# Altium project ESP32_LED_Matrix_Heirarchal.PrjPcb
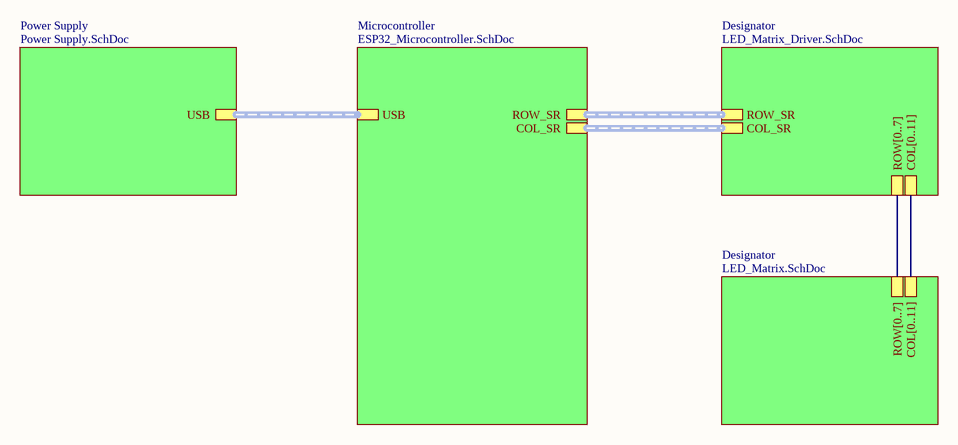
[diagram p0: ESP32_LED_Matrix.SchDoc]
5 sheets, 168 parts. Net scope: hierarchical (ports join the sheet entries above them; power ports are global).
Sheets:
  ESP32_LED_Matrix.SchDoc
    Power Supply = Power Supply.SchDoc
    Microcontroller = ESP32_Microcontroller.SchDoc
    Designator = LED_Matrix_Driver.SchDoc
    Designator = LED_Matrix.SchDoc

## Sheet ESP32_LED_Matrix.SchDoc
size A4; SheetNumber: 1; SheetTotal: 5

### Sub-sheets
Designator = LED_Matrix_Driver.SchDoc: COL_SR (harness COL_SR), ROW_SR (harness ROW_SR), ROW[0..7], COL[0..11]
Designator = LED_Matrix.SchDoc: COL[0..11], ROW[0..7]
Microcontroller = ESP32_Microcontroller.SchDoc: COL_SR (harness COL_SR), ROW_SR (harness ROW_SR), USB (harness USB)
Power Supply = Power Supply.SchDoc: USB (harness USB)

### Buses and harness runs
harness sheet Designator/COL_SR = sheet Microcontroller/COL_SR
harness sheet Designator/ROW_SR = sheet Microcontroller/ROW_SR
harness sheet Microcontroller/USB = sheet Power Supply/USB

## Sheet Power Supply.SchDoc
size A4; SheetNumber: 2; SheetTotal: 3
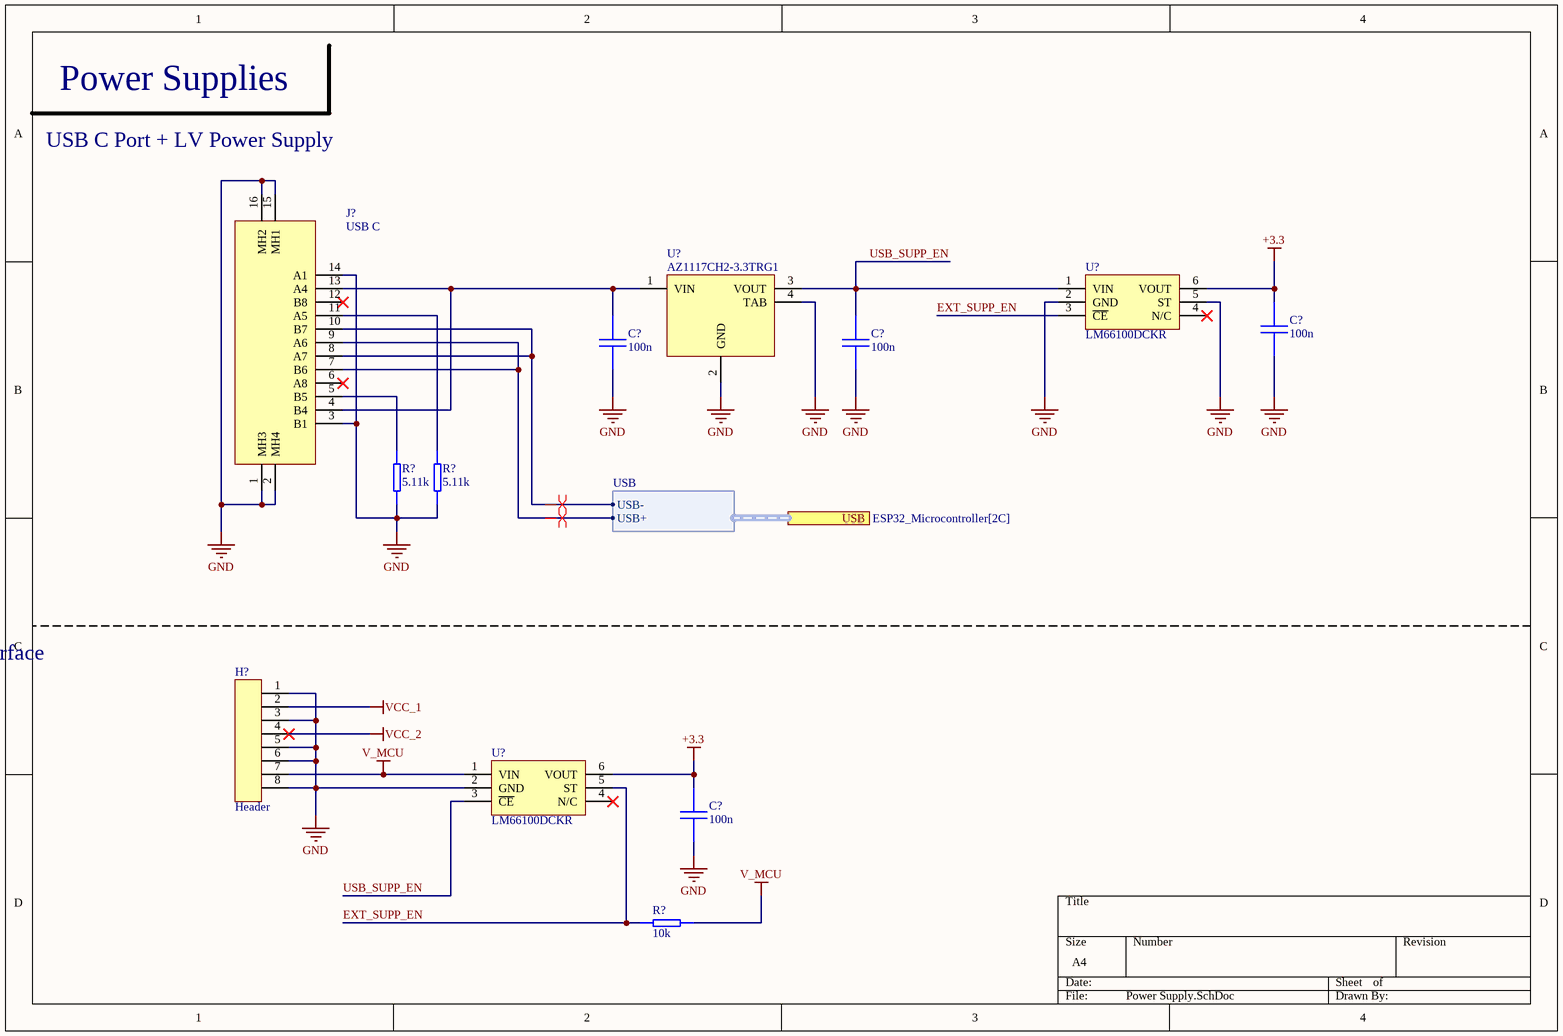
[diagram p1: Power Supply.SchDoc]

### Parts
(Parts that share a designator on the sheet are numbered #1, #2 ... from top to bottom, then left to right.)
C?#1  100n  [CAP0805]
C?#2  100n  [CAP0805]
C?#3  100n  [CAP0805]
C?#4  100n  [CAP0805]
H?  Header  [Header_1X8]
J?  USB C  [USB TYPE C 12 PIN]
R?#1  5.11k  [RESC0805]
R?#2  5.11k  [RESC0805]
R?#3  10k  [RESC0805]
U?#1  AZ1117CH2-3.3TRG1  [SOT223]
U?#2  LM66100DCKR  [SC70-6]
U?#3  LM66100DCKR  [SC70-6]

### Ports
USB (harness USB, see ESP32_Microcontroller[2C])

### Harnesses
USB: USB-, USB+

### Nets
+3.3: C?#1.1 C?#4.1 U?#2.6(VOUT) U?#3.6(VOUT)
GND: C?#1.2 C?#2.2 C?#3.2 C?#4.2 H?.1 H?.3 H?.5 H?.6 H?.8 J?.1(MH3) J?.2(MH4) J?.3(B1) J?.14(A1) J?.15(MH1) J?.16(MH2) R?#1.1 R?#2.1 U?#1.2(GND) U?#1.4(TAB) U?#2.2(GND) U?#2.5(ST) U?#3.2(GND)
V_MCU: H?.7 R?#3.2 U?#3.1(VIN)
VCC_1: H?.2
VCC_2: H?.4
EXT_SUPP_EN: R?#3.1 U?#2.3(~{CE}) U?#3.5(ST)
USB_D_N: J?.8(A7) J?.10(B7) ; port USB.USB-
USB_D_P: J?.7(B6) J?.9(A6) ; port USB.USB+
USB_SUPP_EN: C?#3.1 U?#1.3(VOUT) U?#2.1(VIN) U?#3.3(~{CE})
NetC?#2_1: C?#2.1 J?.4(B4) J?.13(A4) U?#1.1(VIN)
NetJ?_5: J?.5(B5) R?#1.2
NetJ?_11: J?.11(A5) R?#2.2

Not connected (* = marked no-connect by the designer): J? 6(A8)* 12(B8)*; U?#2 4(N/C)*; U?#3 4(N/C)*

### Layout directives
differential pair: USB_D_N, USB_D_P

### Notes on the sheet
- Power Supplies
- USB C Port + LV Power Supply
- Power Interface

### Library data of the parts
C?#1-C?#4 = Capacitor - Non Polarized: Non Polarized Capacitor
H? = 8-Pin Header: System: Connector
J? = USB Type C Connector 12 Pin
R?#1-R?#3 = Resistor
U?#1 = AZ1117CH2-3.3TRG1_1: 3.3V Linear Voltage Regulator
U?#2 U?#3 = LM66100DCKR: 5.5-V, 1.5-A 79-mΩ, Low IQ Ideal Diode With Input Polarity Protection; Manufacturer_Name: Texas Instruments; Datasheet Link: http://www.ti.com/lit/gpn/LM66100; Height: 1.1mm; Manufacturer_Part_Number: LM66100DCKR; Mouser Part Number: 595-LM66100DCKR; Mouser Price/Stock: https://www.mouser.co.uk/ProductDetail/Texas-Instruments/LM66100DCKR?qs=vLWxofP3U2y2yPPrXoBBoA%3D%3D; Arrow Part Number: LM66100DCKR; Arrow Price/Stock: https://www.arrow.com/en/products/lm66100dckr/texas-instruments?region=nac

## Sheet ESP32_Microcontroller.SchDoc
size A4; SheetNumber: 2; SheetTotal: 4
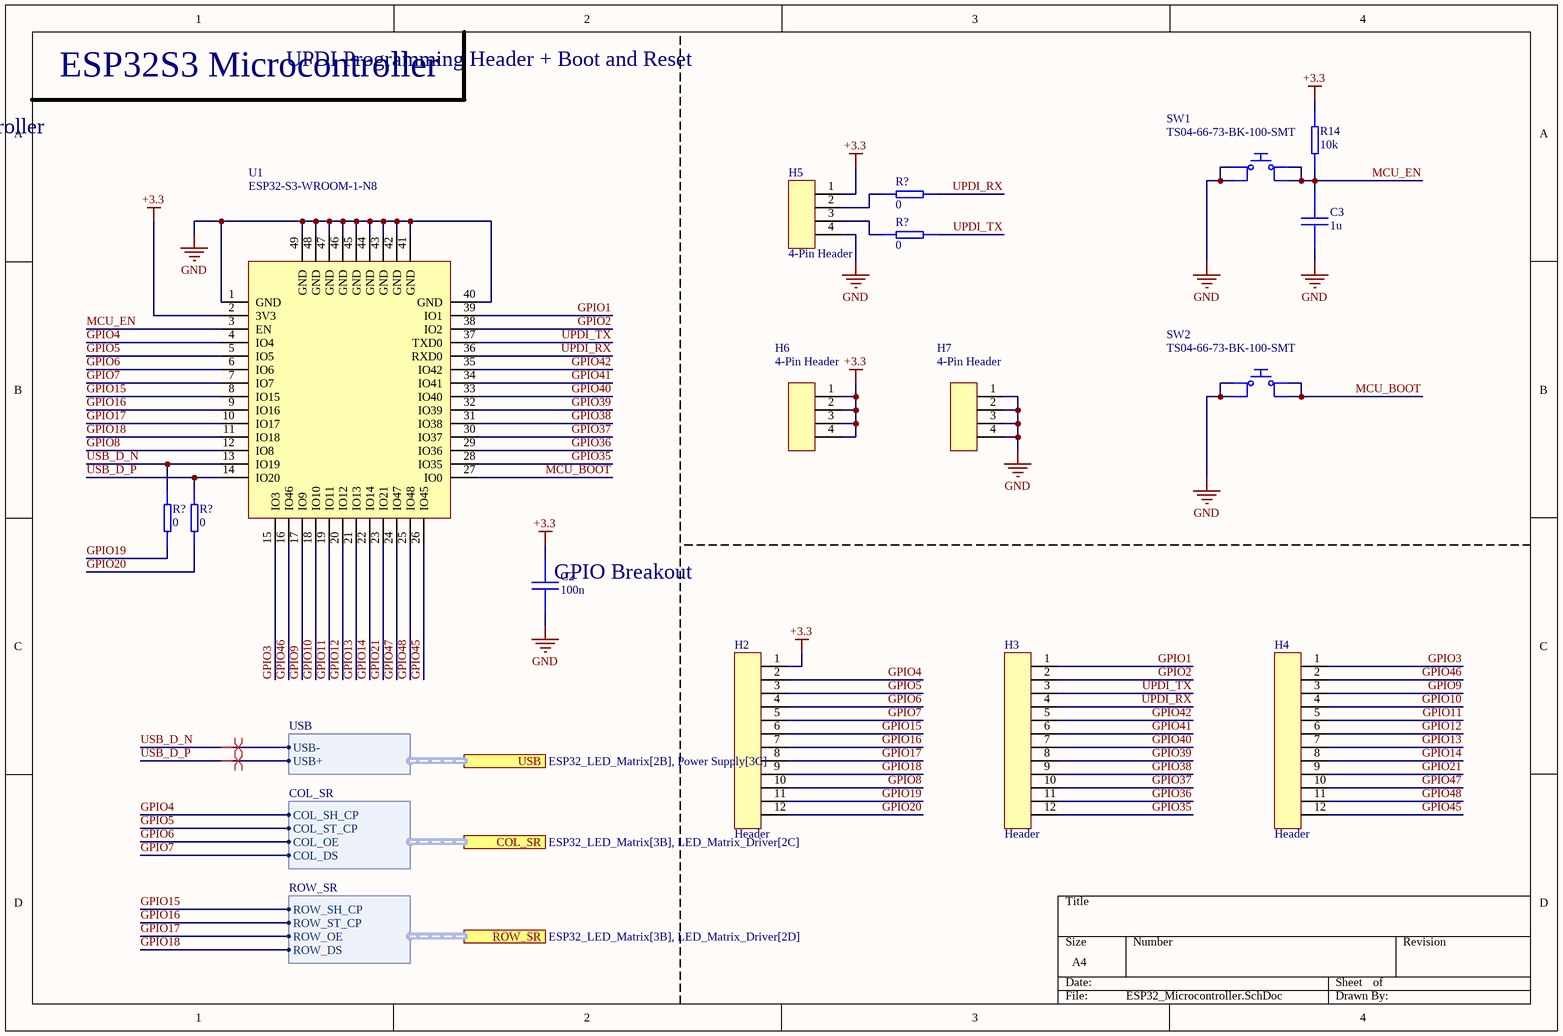
[diagram p2: ESP32_Microcontroller.SchDoc]

### Parts
(Parts that share a designator on the sheet are numbered #1, #2 ... from top to bottom, then left to right.)
C2  100n  [CAP0805]
C3  1u  [CAP0805]
H2  Header  [Header_1X12]
H3  Header  [Header_1X12]
H4  Header  [Header_1X12]
H5  4-Pin Header  [Header_1X4]
H6  4-Pin Header  [Header_1X4]
H7  4-Pin Header  [Header_1X4]
R14  10k  [RESC0805]
R?#4  0  [RESC0805]
R?#5  0  [RESC0805]
R?#6  0  [RESC0805]
R?#7  0  [RESC0805]
SW1  TS04-66-73-BK-100-SMT  [Tactile Button 6.0mm x 6.0mm]
SW2  TS04-66-73-BK-100-SMT  [Tactile Button 6.0mm x 6.0mm]
U1  ESP32-S3-WROOM-1-N8  [ESP32-S3-WROOM-1-N8]

### Ports
COL_SR (harness COL_SR, see ESP32_LED_Matrix[3B], LED_Matrix_Driver[2C]), ROW_SR (harness ROW_SR, see ESP32_LED_Matrix[3B], LED_Matrix_Driver[2D]), USB (harness USB, see ESP32_LED_Matrix[2B], Power Supply[3C])

### Harnesses
COL_SR: COL_SH_CP, COL_ST_CP, COL_OE, COL_DS
ROW_SR: ROW_SH_CP, ROW_ST_CP, ROW_OE, ROW_DS
USB: USB-, USB+

### Nets
+3.3: C2.1 H2.1 H5.1 H6.1 H6.2 H6.3 H6.4 R14.1 U1.2(3V3)
GND: C2.2 C3.2 H5.4 H7.1 H7.2 H7.3 H7.4 SW1.1 SW1.2 SW2.1 SW2.2 U1.1(GND) U1.40(GND) U1.41(GND) U1.42(GND) U1.43(GND) U1.44(GND) U1.45(GND) U1.46(GND) U1.47(GND) U1.48(GND) U1.49(GND)
GPIO1: H3.1 U1.39(IO1)
GPIO2: H3.2 U1.38(IO2)
GPIO3: H4.1 U1.15(IO3)
GPIO4: H2.2 U1.4(IO4) ; port COL_SR.COL_SH_CP  [project net COL_SH_CP]
GPIO5: H2.3 U1.5(IO5) ; port COL_SR.COL_ST_CP  [project net COL_ST_CP]
GPIO6: H2.4 U1.6(IO6) ; port COL_SR.COL_OE  [project net COL_OE]
GPIO7: H2.5 U1.7(IO7) ; port COL_SR.COL_DS  [project net COL_DS]
GPIO8: H2.10 U1.12(IO8)
GPIO9: H4.3 U1.17(IO9)
GPIO10: H4.4 U1.18(IO10)
GPIO11: H4.5 U1.19(IO11)
GPIO12: H4.6 U1.20(IO12)
GPIO13: H4.7 U1.21(IO13)
GPIO14: H4.8 U1.22(IO14)
GPIO15: H2.6 U1.8(IO15) ; port ROW_SR.ROW_SH_CP
GPIO16: H2.7 U1.9(IO16) ; port ROW_SR.ROW_ST_CP
GPIO17: H2.8 U1.10(IO17) ; port ROW_SR.ROW_OE
GPIO18: H2.9 U1.11(IO18) ; port ROW_SR.ROW_DS
GPIO19: H2.11 R?#6.1
GPIO20: H2.12 R?#7.1
GPIO21: H4.9 U1.23(IO21)
GPIO35: H3.12 U1.28(IO35)
GPIO36: H3.11 U1.29(IO36)
GPIO37: H3.10 U1.30(IO37)
GPIO38: H3.9 U1.31(IO38)
GPIO39: H3.8 U1.32(IO39)
GPIO40: H3.7 U1.33(IO40)
GPIO41: H3.6 U1.34(IO41)
GPIO42: H3.5 U1.35(IO42)
GPIO45: H4.12 U1.26(IO45)
GPIO46: H4.2 U1.16(IO46)
GPIO47: H4.10 U1.24(IO47)
GPIO48: H4.11 U1.25(IO48)
MCU_BOOT: SW2.3 SW2.4 U1.27(IO0)
MCU_EN: C3.1 R14.2 SW1.3 SW1.4 U1.3(EN)
UPDI_RX: H3.4 R?#4.1 U1.36(RXD0)
UPDI_TX: H3.3 R?#5.1 U1.37(TXD0)
USB_D_N: R?#6.2 U1.13(IO19) ; port USB.USB-
USB_D_P: R?#7.2 U1.14(IO20) ; port USB.USB+
NetH5_2: H5.2 R?#4.2
NetH5_3: H5.3 R?#5.2

### Layout directives
differential pair: USB_D_N, USB_D_P

### Notes on the sheet
- ESP32S3 Microcontroller
- UPDI Programming Header + Boot and Reset
- Microcontroller
- GPIO Breakout

### Library data of the parts
C2 C3 = Capacitor - Non Polarized: Non Polarized Capacitor
H2-H4 = 12-Pin Header
R14 R?#4-R?#7 = Resistor
SW1 SW2 = TS04-66-73-BK-100-SMT: Switch; Manufacturer_Name: Same Sky; Datasheet Link: https://www.sameskydevices.com/product/resource/supplyframepdf/ts04.pdf; Height: 7.6mm; Manufacturer_Part_Number: TS04-66-73-BK-100-SMT; Mouser Part Number: 179-TS046673BK100SMT; Mouser Price/Stock: https://www.mouser.co.uk/ProductDetail/Same-Sky/TS04-66-73-BK-100-SMT?qs=A6eO%252BMLsxmRAmp3wqRUzZw%3D%3D; Arrow Part Number: TS04-66-73-BK-100-SMT; Arrow Price/Stock: https://www.arrow.com/en/products/ts04-66-73-bk-100-smt/cui-devices?utm_currency=USD&region=nac
U1 = ESP32-S3-WROOM-1-N8: ESP32 Microcontroller with Bluetooth and Wifi

## Sheet LED_Matrix_Driver.SchDoc
size A3; SheetNumber: 4; SheetTotal: 4
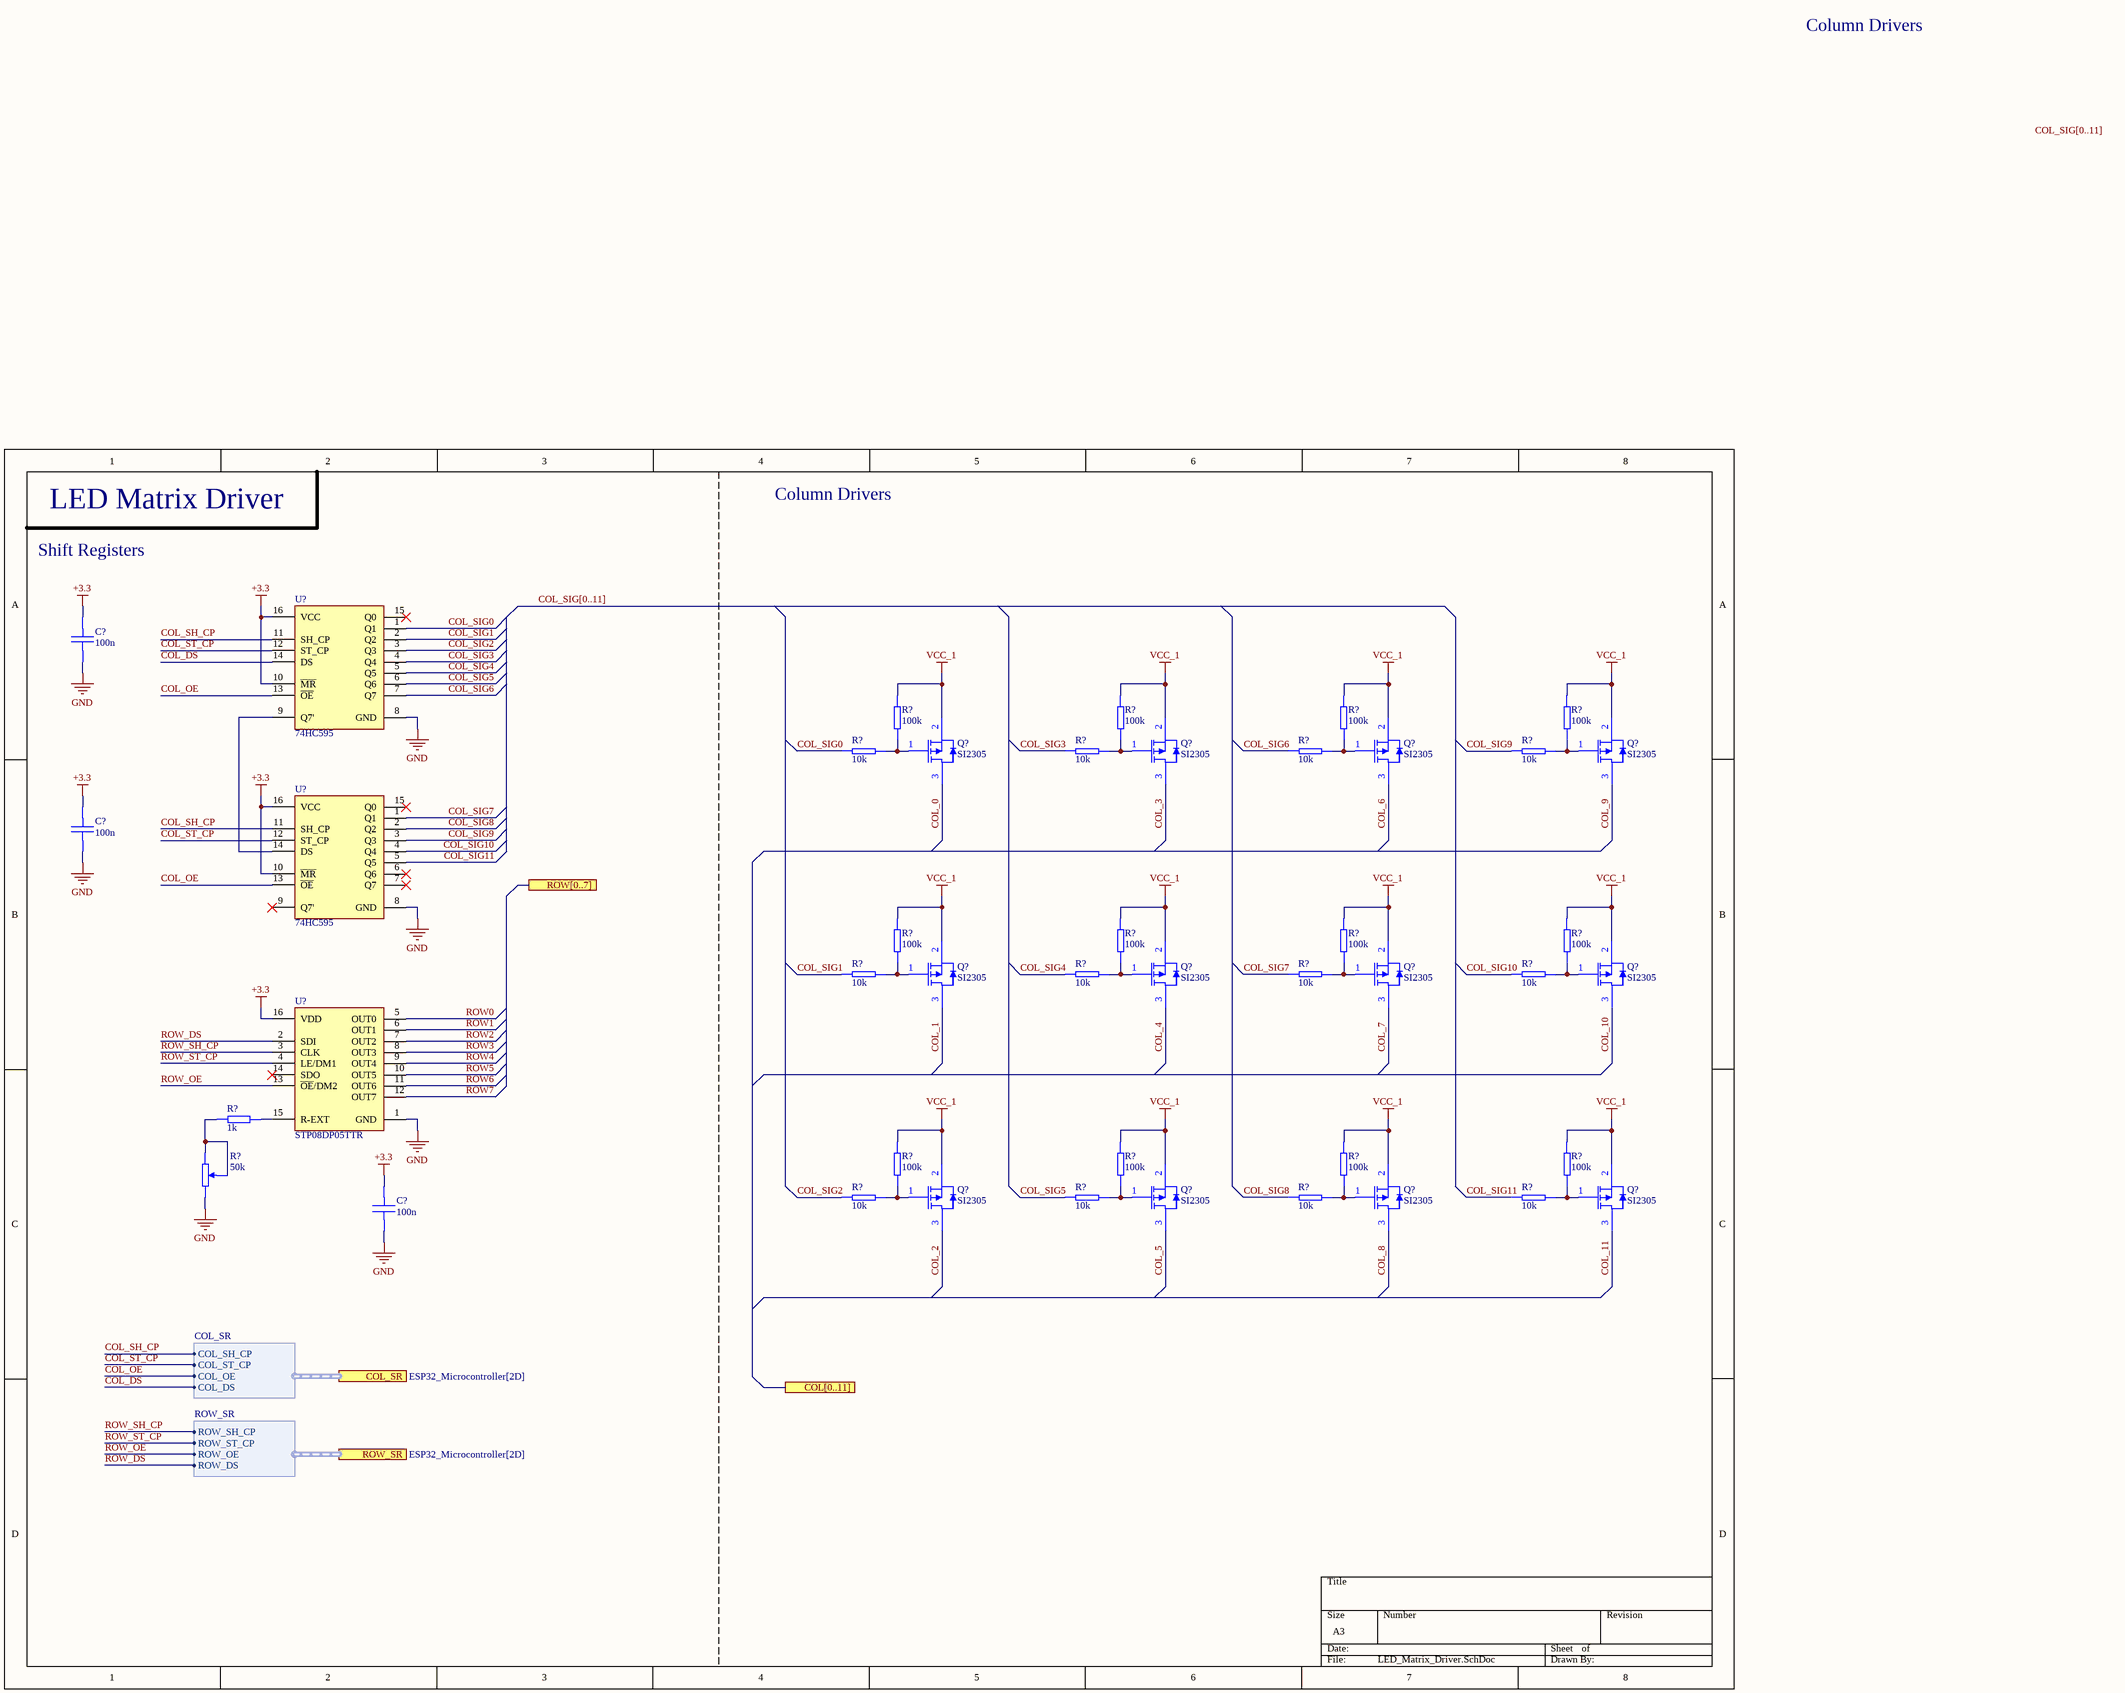
[diagram p3: LED_Matrix_Driver.SchDoc]

### Parts
(Parts that share a designator on the sheet are numbered #1, #2 ... from top to bottom, then left to right.)
C?#5  100n  [CAP0805]
C?#6  100n  [CAP0805]
C?#7  100n  [CAP0805]
Q?#1  SI2305  [SOT23]
Q?#2  SI2305  [SOT23]
Q?#3  SI2305  [SOT23]
Q?#4  SI2305  [SOT23]
Q?#5  SI2305  [SOT23]
Q?#6  SI2305  [SOT23]
Q?#7  SI2305  [SOT23]
Q?#8  SI2305  [SOT23]
Q?#9  SI2305  [SOT23]
Q?#10  SI2305  [SOT23]
Q?#11  SI2305  [SOT23]
Q?#12  SI2305  [SOT23]
R?#8  100k  [RESC0805]
R?#9  100k  [RESC0805]
R?#10  100k  [RESC0805]
R?#11  100k  [RESC0805]
R?#12  10k  [RESC0805]
R?#13  10k  [RESC0805]
R?#14  10k  [RESC0805]
R?#15  10k  [RESC0805]
R?#16  100k  [RESC0805]
R?#17  100k  [RESC0805]
R?#18  100k  [RESC0805]
R?#19  100k  [RESC0805]
R?#20  10k  [RESC0805]
R?#21  10k  [RESC0805]
R?#22  10k  [RESC0805]
R?#23  10k  [RESC0805]
R?#24  1k  [RESC0805]
R?#25  100k  [RESC0805]
R?#26  100k  [RESC0805]
R?#27  100k  [RESC0805]
R?#28  100k  [RESC0805]
R?#29  50k  [3339P1103LF]
R?#30  10k  [RESC0805]
R?#31  10k  [RESC0805]
R?#32  10k  [RESC0805]
R?#33  10k  [RESC0805]
U?#4  74HC595  [TSSOP16]
U?#5  74HC595  [TSSOP16]
U?#6  STP08DP05TTR  [TSSOP16]

### Ports
COL[0..11], COL_SR (harness COL_SR, see ESP32_Microcontroller[2D]), ROW[0..7], ROW_SR (harness ROW_SR, see ESP32_Microcontroller[2D])

### Harnesses
COL_SR: COL_SH_CP, COL_ST_CP, COL_OE, COL_DS
ROW_SR: ROW_SH_CP, ROW_ST_CP, ROW_OE, ROW_DS

### Nets
+3.3: C?#5.1 C?#6.1 C?#7.1 U?#4.10(~{MR}) U?#4.16(VCC) U?#5.10(~{MR}) U?#5.16(VCC) U?#6.16(VDD)
GND: C?#5.2 C?#6.2 C?#7.2 R?#29.3 U?#4.8(GND) U?#5.8(GND) U?#6.1(GND)
VCC_1: Q?#1.2(S) Q?#2.2(S) Q?#3.2(S) Q?#4.2(S) Q?#5.2(S) Q?#6.2(S) Q?#7.2(S) Q?#8.2(S) Q?#9.2(S) Q?#10.2(S) Q?#11.2(S) Q?#12.2(S) R?#8.1 R?#9.1 R?#10.1 R?#11.1 R?#16.1 R?#17.1 R?#18.1 R?#19.1 R?#25.1 R?#26.1 R?#27.1 R?#28.1
COL_0: Q?#1.3(D)
COL_1: Q?#5.3(D)
COL_2: Q?#9.3(D)
COL_3: Q?#2.3(D)
COL_4: Q?#6.3(D)
COL_5: Q?#10.3(D)
COL_6: Q?#3.3(D)
COL_7: Q?#7.3(D)
COL_8: Q?#11.3(D)
COL_9: Q?#4.3(D)
COL_10: Q?#8.3(D)
COL_11: Q?#12.3(D)
COL_DS: U?#4.14(DS) ; port COL_SR.COL_DS
COL_OE: U?#4.13(~{OE}) U?#5.13(~{OE}) ; port COL_SR.COL_OE
COL_SH_CP: U?#4.11(SH_CP) U?#5.11(SH_CP) ; port COL_SR.COL_SH_CP
COL_SIG0: R?#12.1 U?#4.1(Q1)
COL_SIG1: R?#20.1 U?#4.2(Q2)
COL_SIG2: R?#30.1 U?#4.3(Q3)
COL_SIG3: R?#13.1 U?#4.4(Q4)
COL_SIG4: R?#21.1 U?#4.5(Q5)
COL_SIG5: R?#31.1 U?#4.6(Q6)
COL_SIG6: R?#14.1 U?#4.7(Q7)
COL_SIG7: R?#22.1 U?#5.1(Q1)
COL_SIG8: R?#32.1 U?#5.2(Q2)
COL_SIG9: R?#15.1 U?#5.3(Q3)
COL_SIG10: R?#23.1 U?#5.4(Q4)
COL_SIG11: R?#33.1 U?#5.5(Q5)
COL_ST_CP: U?#4.12(ST_CP) U?#5.12(ST_CP) ; port COL_SR.COL_ST_CP
ROW0: U?#6.5(OUT0)
ROW1: U?#6.6(OUT1)
ROW2: U?#6.7(OUT2)
ROW3: U?#6.8(OUT3)
ROW4: U?#6.9(OUT4)
ROW5: U?#6.10(OUT5)
ROW6: U?#6.11(OUT6)
ROW7: U?#6.12(OUT7)
ROW_DS: U?#6.2(SDI) ; port ROW_SR.ROW_DS  [project net GPIO18]
ROW_OE: U?#6.13(~{OE}/DM2) ; port ROW_SR.ROW_OE  [project net GPIO17]
ROW_SH_CP: U?#6.3(CLK) ; port ROW_SR.ROW_SH_CP  [project net GPIO15]
ROW_ST_CP: U?#6.4(LE/DM1) ; port ROW_SR.ROW_ST_CP  [project net GPIO16]
NetQ?#1_1: Q?#1.1(G) R?#8.2 R?#12.2
NetQ?#2_1: Q?#2.1(G) R?#9.2 R?#13.2
NetQ?#3_1: Q?#3.1(G) R?#10.2 R?#14.2
NetQ?#4_1: Q?#4.1(G) R?#11.2 R?#15.2
NetQ?#5_1: Q?#5.1(G) R?#16.2 R?#20.2
NetQ?#6_1: Q?#6.1(G) R?#17.2 R?#21.2
NetQ?#7_1: Q?#7.1(G) R?#18.2 R?#22.2
NetQ?#8_1: Q?#8.1(G) R?#19.2 R?#23.2
NetQ?#9_1: Q?#9.1(G) R?#25.2 R?#30.2
NetQ?#10_1: Q?#10.1(G) R?#26.2 R?#31.2
NetQ?#11_1: Q?#11.1(G) R?#27.2 R?#32.2
NetQ?#12_1: Q?#12.1(G) R?#28.2 R?#33.2
NetR?#24_1: R?#24.1 U?#6.15(R-EXT)
NetR?#24_2: R?#24.2 R?#29.1 R?#29.2
NetU?#4_9: U?#4.9(Q7') U?#5.14(DS)

Not connected (* = marked no-connect by the designer): U?#4 15(Q0)*; U?#5 6(Q6)* 7(Q7)* 9(Q7')* 15(Q0)*; U?#6 14(SDO)*

### Buses and harness runs
bus COL_SIG[0..11]

### Notes on the sheet
- Column Drivers
- LED Matrix Driver
- Shift Registers
- Labels drawn without touching a wire or pin: COL_SIG[0..11]

### Library data of the parts
C?#5-C?#7 = Capacitor - Non Polarized: Non Polarized Capacitor
Q?#1-Q?#12 = SI2305: General Purpose P-Channel MOSFET; ComponentLink1Description: Datasheet; ComponentLink1URL: https://www.vishay.com/docs/64847/si2305cd.pdf
R?#8-R?#28 R?#30-R?#33 = Resistor
R?#29 = Potentiometer: Potentionmeter
U?#4 U?#5 = 74HC595: Shift Register
U?#6 = STP08DP05TTR: LED Driver; Manufacturer_Name: STMicroelectronics; Datasheet Link: https://componentsearchengine.com/Datasheets/2/STP08DP05TTR.pdf; Height: 1.2mm; Manufacturer_Part_Number: STP08DP05TTR; Mouser Part Number: 511-STP08DP05TTR; Mouser Price/Stock: https://www.mouser.co.uk/ProductDetail/STMicroelectronics/STP08DP05TTR?qs=xgiOkRdDJ0m7T%2FaY25F5vQ%3D%3D; Arrow Part Number: STP08DP05TTR; Arrow Price/Stock: https://www.arrow.com/en/products/stp08dp05ttr/stmicroelectronics?region=nac

## Sheet LED_Matrix.SchDoc
size A3; SheetNumber: 3; SheetTotal: 3
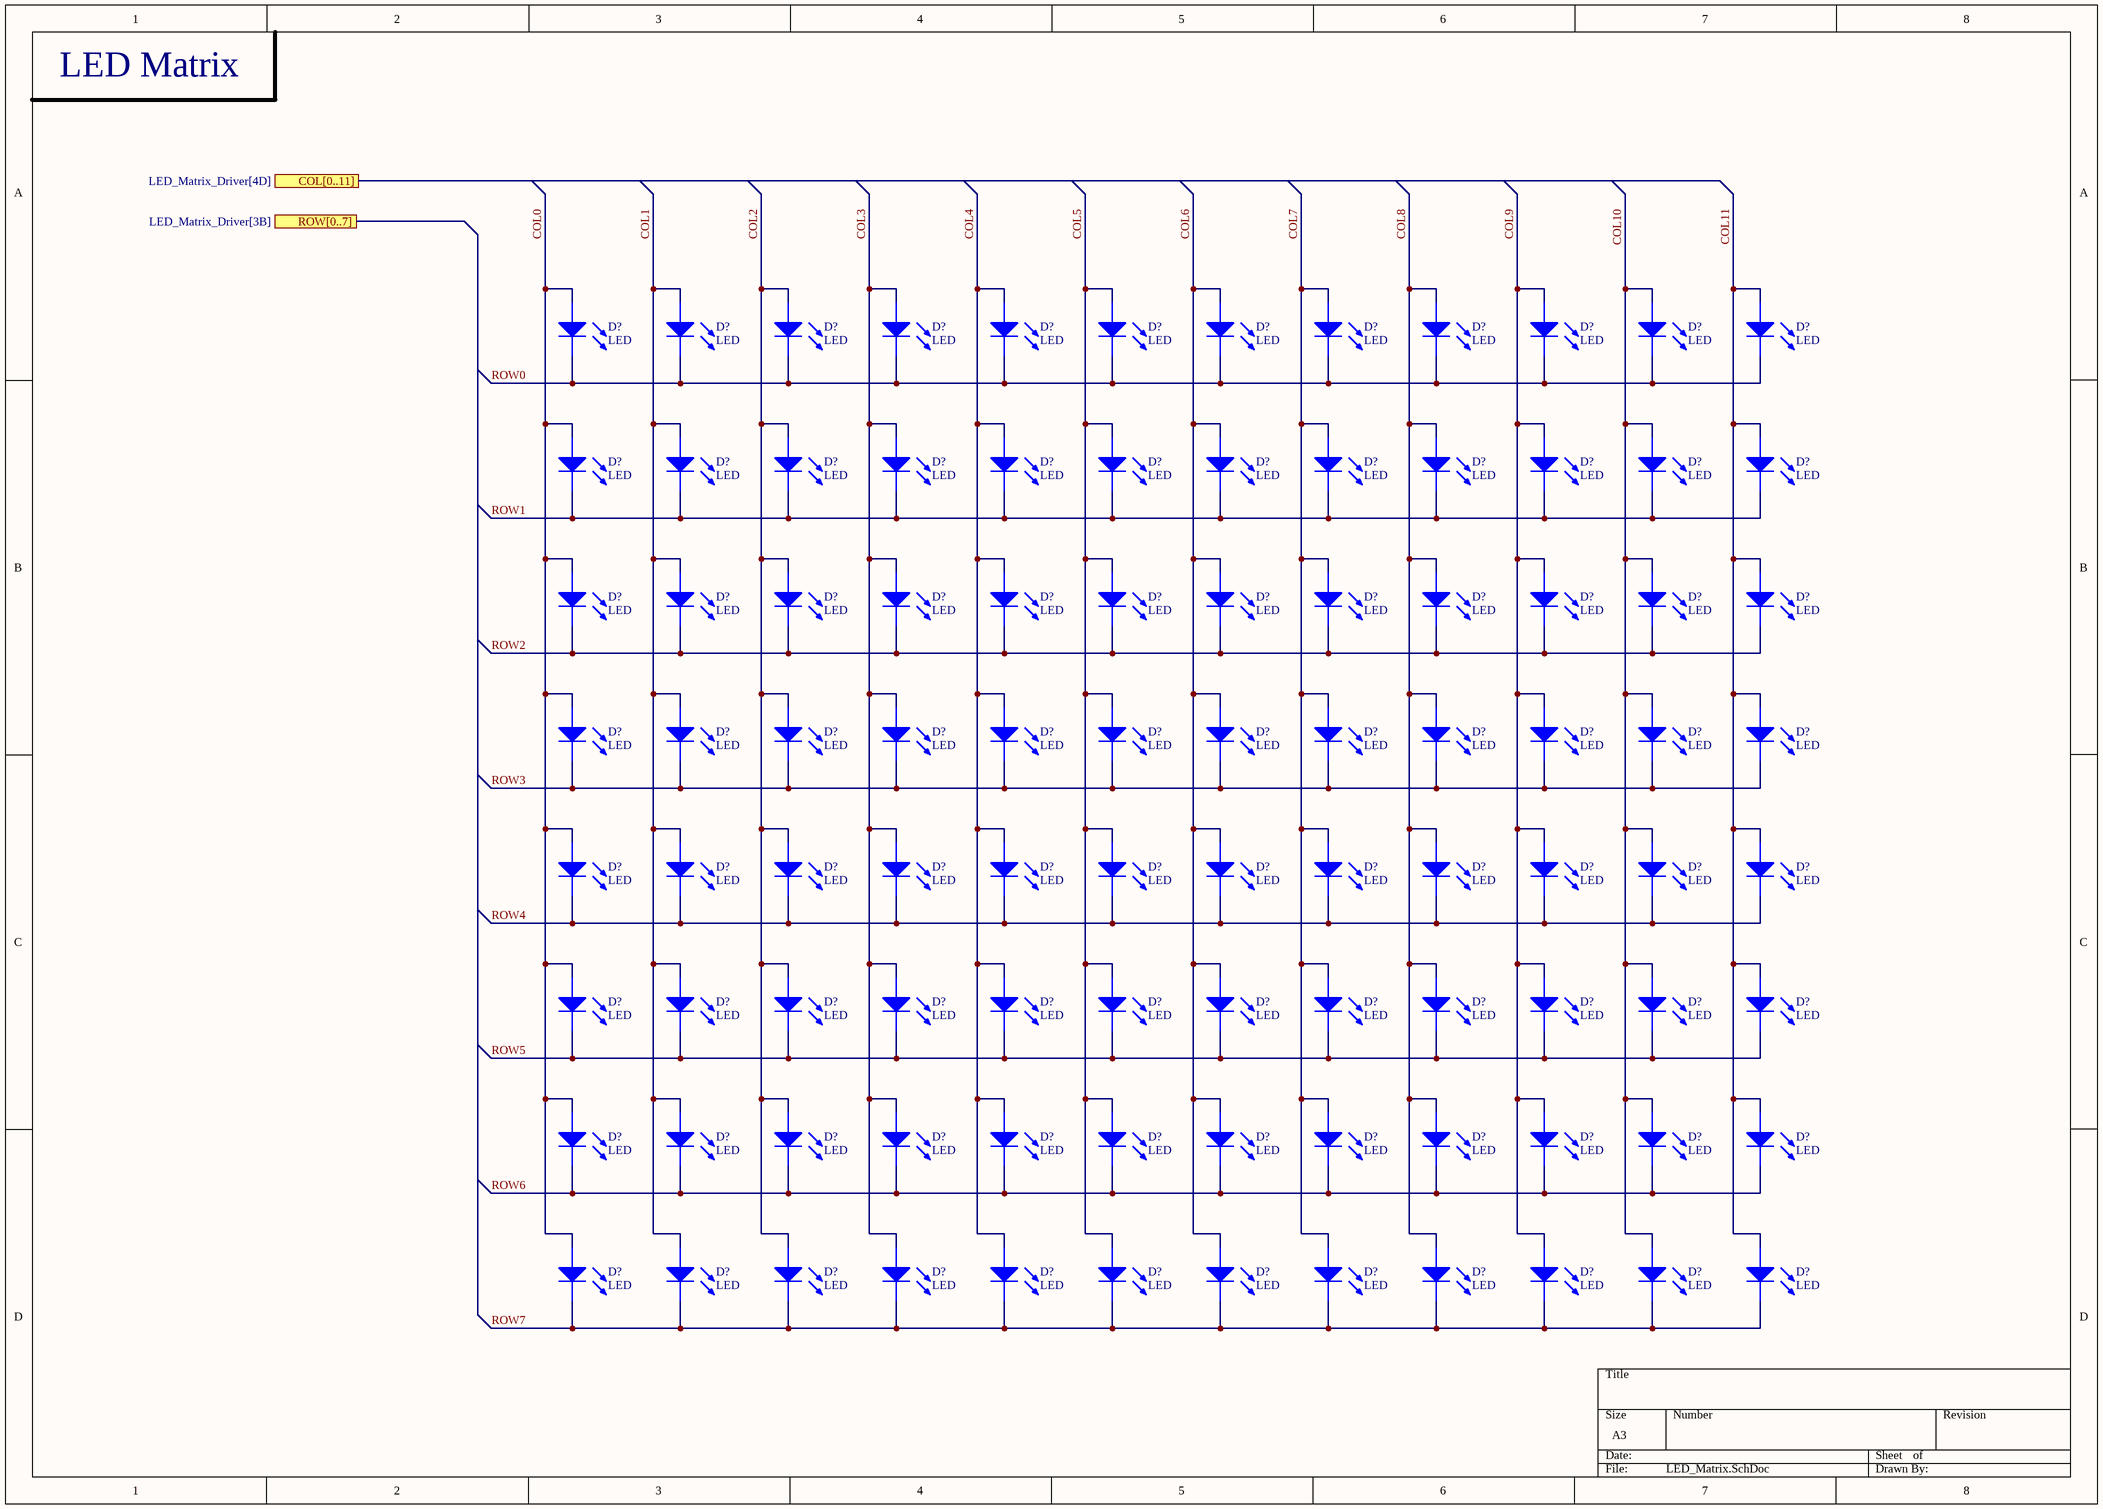
[diagram p4: LED_Matrix.SchDoc]

### Parts
(Parts that share a designator on the sheet are numbered #1, #2 ... from top to bottom, then left to right.)
D?#1  LED  [LEDM2012X80N]
D?#2  LED  [LEDM2012X80N]
D?#3  LED  [LEDM2012X80N]
D?#4  LED  [LEDM2012X80N]
D?#5  LED  [LEDM2012X80N]
D?#6  LED  [LEDM2012X80N]
D?#7  LED  [LEDM2012X80N]
D?#8  LED  [LEDM2012X80N]
D?#9  LED  [LEDM2012X80N]
D?#10  LED  [LEDM2012X80N]
D?#11  LED  [LEDM2012X80N]
D?#12  LED  [LEDM2012X80N]
D?#13  LED  [LEDM2012X80N]
D?#14  LED  [LEDM2012X80N]
D?#15  LED  [LEDM2012X80N]
D?#16  LED  [LEDM2012X80N]
D?#17  LED  [LEDM2012X80N]
D?#18  LED  [LEDM2012X80N]
D?#19  LED  [LEDM2012X80N]
D?#20  LED  [LEDM2012X80N]
D?#21  LED  [LEDM2012X80N]
D?#22  LED  [LEDM2012X80N]
D?#23  LED  [LEDM2012X80N]
D?#24  LED  [LEDM2012X80N]
D?#25  LED  [LEDM2012X80N]
D?#26  LED  [LEDM2012X80N]
D?#27  LED  [LEDM2012X80N]
D?#28  LED  [LEDM2012X80N]
D?#29  LED  [LEDM2012X80N]
D?#30  LED  [LEDM2012X80N]
D?#31  LED  [LEDM2012X80N]
D?#32  LED  [LEDM2012X80N]
D?#33  LED  [LEDM2012X80N]
D?#34  LED  [LEDM2012X80N]
D?#35  LED  [LEDM2012X80N]
D?#36  LED  [LEDM2012X80N]
D?#37  LED  [LEDM2012X80N]
D?#38  LED  [LEDM2012X80N]
D?#39  LED  [LEDM2012X80N]
D?#40  LED  [LEDM2012X80N]
D?#41  LED  [LEDM2012X80N]
D?#42  LED  [LEDM2012X80N]
D?#43  LED  [LEDM2012X80N]
D?#44  LED  [LEDM2012X80N]
D?#45  LED  [LEDM2012X80N]
D?#46  LED  [LEDM2012X80N]
D?#47  LED  [LEDM2012X80N]
D?#48  LED  [LEDM2012X80N]
D?#49  LED  [LEDM2012X80N]
D?#50  LED  [LEDM2012X80N]
D?#51  LED  [LEDM2012X80N]
D?#52  LED  [LEDM2012X80N]
D?#53  LED  [LEDM2012X80N]
D?#54  LED  [LEDM2012X80N]
D?#55  LED  [LEDM2012X80N]
D?#56  LED  [LEDM2012X80N]
D?#57  LED  [LEDM2012X80N]
D?#58  LED  [LEDM2012X80N]
D?#59  LED  [LEDM2012X80N]
D?#60  LED  [LEDM2012X80N]
D?#61  LED  [LEDM2012X80N]
D?#62  LED  [LEDM2012X80N]
D?#63  LED  [LEDM2012X80N]
D?#64  LED  [LEDM2012X80N]
D?#65  LED  [LEDM2012X80N]
D?#66  LED  [LEDM2012X80N]
D?#67  LED  [LEDM2012X80N]
D?#68  LED  [LEDM2012X80N]
D?#69  LED  [LEDM2012X80N]
D?#70  LED  [LEDM2012X80N]
D?#71  LED  [LEDM2012X80N]
D?#72  LED  [LEDM2012X80N]
D?#73  LED  [LEDM2012X80N]
D?#74  LED  [LEDM2012X80N]
D?#75  LED  [LEDM2012X80N]
D?#76  LED  [LEDM2012X80N]
D?#77  LED  [LEDM2012X80N]
D?#78  LED  [LEDM2012X80N]
D?#79  LED  [LEDM2012X80N]
D?#80  LED  [LEDM2012X80N]
D?#81  LED  [LEDM2012X80N]
D?#82  LED  [LEDM2012X80N]
D?#83  LED  [LEDM2012X80N]
D?#84  LED  [LEDM2012X80N]
D?#85  LED  [LEDM2012X80N]
D?#86  LED  [LEDM2012X80N]
D?#87  LED  [LEDM2012X80N]
D?#88  LED  [LEDM2012X80N]
D?#89  LED  [LEDM2012X80N]
D?#90  LED  [LEDM2012X80N]
D?#91  LED  [LEDM2012X80N]
D?#92  LED  [LEDM2012X80N]
D?#93  LED  [LEDM2012X80N]
D?#94  LED  [LEDM2012X80N]
D?#95  LED  [LEDM2012X80N]
D?#96  LED  [LEDM2012X80N]

### Ports
COL[0..11] (see LED_Matrix_Driver[4D]), ROW[0..7] (see LED_Matrix_Driver[3B])

### Nets
COL0: D?#1.2(A) D?#13.2(A) D?#25.2(A) D?#37.2(A) D?#49.2(A) D?#61.2(A) D?#73.2(A) D?#85.2(A)
COL1: D?#2.2(A) D?#14.2(A) D?#26.2(A) D?#38.2(A) D?#50.2(A) D?#62.2(A) D?#74.2(A) D?#86.2(A)
COL2: D?#3.2(A) D?#15.2(A) D?#27.2(A) D?#39.2(A) D?#51.2(A) D?#63.2(A) D?#75.2(A) D?#87.2(A)
COL3: D?#4.2(A) D?#16.2(A) D?#28.2(A) D?#40.2(A) D?#52.2(A) D?#64.2(A) D?#76.2(A) D?#88.2(A)
COL4: D?#5.2(A) D?#17.2(A) D?#29.2(A) D?#41.2(A) D?#53.2(A) D?#65.2(A) D?#77.2(A) D?#89.2(A)
COL5: D?#6.2(A) D?#18.2(A) D?#30.2(A) D?#42.2(A) D?#54.2(A) D?#66.2(A) D?#78.2(A) D?#90.2(A)
COL6: D?#7.2(A) D?#19.2(A) D?#31.2(A) D?#43.2(A) D?#55.2(A) D?#67.2(A) D?#79.2(A) D?#91.2(A)
COL7: D?#8.2(A) D?#20.2(A) D?#32.2(A) D?#44.2(A) D?#56.2(A) D?#68.2(A) D?#80.2(A) D?#92.2(A)
COL8: D?#9.2(A) D?#21.2(A) D?#33.2(A) D?#45.2(A) D?#57.2(A) D?#69.2(A) D?#81.2(A) D?#93.2(A)
COL9: D?#10.2(A) D?#22.2(A) D?#34.2(A) D?#46.2(A) D?#58.2(A) D?#70.2(A) D?#82.2(A) D?#94.2(A)
COL10: D?#11.2(A) D?#23.2(A) D?#35.2(A) D?#47.2(A) D?#59.2(A) D?#71.2(A) D?#83.2(A) D?#95.2(A)
COL11: D?#12.2(A) D?#24.2(A) D?#36.2(A) D?#48.2(A) D?#60.2(A) D?#72.2(A) D?#84.2(A) D?#96.2(A)
ROW0: D?#1.1(K) D?#2.1(K) D?#3.1(K) D?#4.1(K) D?#5.1(K) D?#6.1(K) D?#7.1(K) D?#8.1(K) D?#9.1(K) D?#10.1(K) D?#11.1(K) D?#12.1(K)
ROW1: D?#13.1(K) D?#14.1(K) D?#15.1(K) D?#16.1(K) D?#17.1(K) D?#18.1(K) D?#19.1(K) D?#20.1(K) D?#21.1(K) D?#22.1(K) D?#23.1(K) D?#24.1(K)
ROW2: D?#25.1(K) D?#26.1(K) D?#27.1(K) D?#28.1(K) D?#29.1(K) D?#30.1(K) D?#31.1(K) D?#32.1(K) D?#33.1(K) D?#34.1(K) D?#35.1(K) D?#36.1(K)
ROW3: D?#37.1(K) D?#38.1(K) D?#39.1(K) D?#40.1(K) D?#41.1(K) D?#42.1(K) D?#43.1(K) D?#44.1(K) D?#45.1(K) D?#46.1(K) D?#47.1(K) D?#48.1(K)
ROW4: D?#49.1(K) D?#50.1(K) D?#51.1(K) D?#52.1(K) D?#53.1(K) D?#54.1(K) D?#55.1(K) D?#56.1(K) D?#57.1(K) D?#58.1(K) D?#59.1(K) D?#60.1(K)
ROW5: D?#61.1(K) D?#62.1(K) D?#63.1(K) D?#64.1(K) D?#65.1(K) D?#66.1(K) D?#67.1(K) D?#68.1(K) D?#69.1(K) D?#70.1(K) D?#71.1(K) D?#72.1(K)
ROW6: D?#73.1(K) D?#74.1(K) D?#75.1(K) D?#76.1(K) D?#77.1(K) D?#78.1(K) D?#79.1(K) D?#80.1(K) D?#81.1(K) D?#82.1(K) D?#83.1(K) D?#84.1(K)
ROW7: D?#85.1(K) D?#86.1(K) D?#87.1(K) D?#88.1(K) D?#89.1(K) D?#90.1(K) D?#91.1(K) D?#92.1(K) D?#93.1(K) D?#94.1(K) D?#95.1(K) D?#96.1(K)

### Notes on the sheet
- LED Matrix

### Library data of the parts
D?#1-D?#96 = LED: General Purpose LED; ComponentLink1Description: Datasheet; ComponentLink1URL: https://www.smc-diodes.com/propdf/1N4148W%20N0571%20REV.E.pdf

## Nets that join several sheets
+3.3: Power Supply (C?#1.1 C?#4.1 U?#2.6 U?#3.6), ESP32_Microcontroller (9 pins), LED_Matrix_Driver (8 pins)
GND: Power Supply (22 pins), ESP32_Microcontroller (22 pins), LED_Matrix_Driver (7 pins)
VCC_1: Power Supply (H?.2), LED_Matrix_Driver (24 pins)
COL_DS: ESP32_Microcontroller (H2.5 U1.7), LED_Matrix_Driver (U?#4.14)
COL_OE: ESP32_Microcontroller (H2.4 U1.6), LED_Matrix_Driver (U?#4.13 U?#5.13)
COL_SH_CP: ESP32_Microcontroller (H2.2 U1.4), LED_Matrix_Driver (U?#4.11 U?#5.11)
COL_ST_CP: ESP32_Microcontroller (H2.3 U1.5), LED_Matrix_Driver (U?#4.12 U?#5.12)
GPIO15: ESP32_Microcontroller (H2.6 U1.8), LED_Matrix_Driver (U?#6.3)
GPIO16: ESP32_Microcontroller (H2.7 U1.9), LED_Matrix_Driver (U?#6.4)
GPIO17: ESP32_Microcontroller (H2.8 U1.10), LED_Matrix_Driver (U?#6.13)
GPIO18: ESP32_Microcontroller (H2.9 U1.11), LED_Matrix_Driver (U?#6.2)
USB_D_N: Power Supply (J?.8 J?.10), ESP32_Microcontroller (R?#6.2 U1.13)
USB_D_P: Power Supply (J?.7 J?.9), ESP32_Microcontroller (R?#7.2 U1.14)